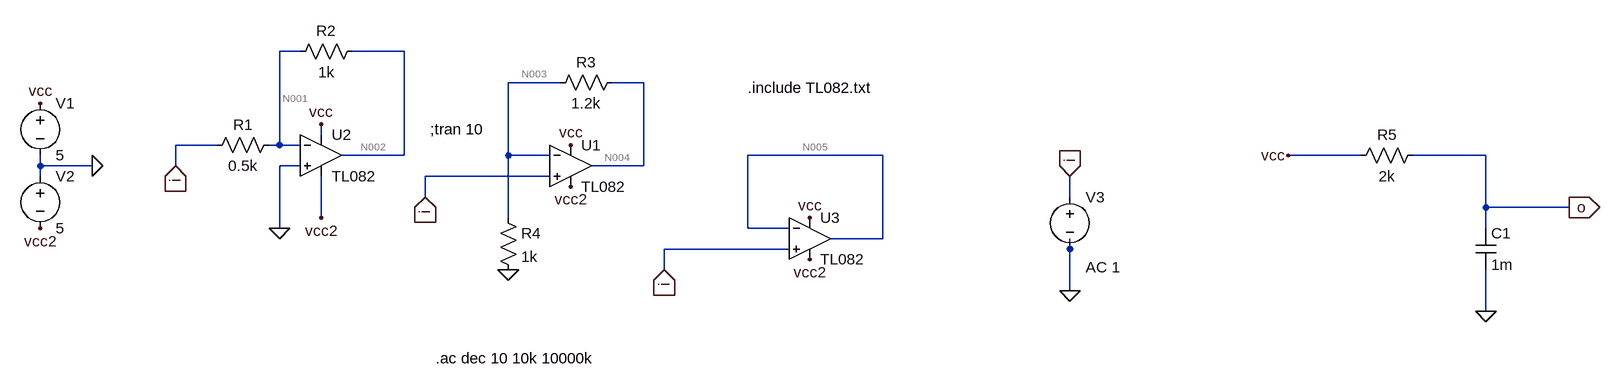
[diagram p0: schematic Wzmacniacze_lab1.asc]
Wzmacniacze_lab1.asc, the LTspice schematic file:
Version 4
SHEET 1 1200 680
WIRE -832 -48 -864 -48
WIRE -672 -48 -752 -48
WIRE -432 0 -512 0
WIRE -304 0 -352 0
WIRE -800 80 -800 64
WIRE -960 96 -1024 96
WIRE -864 96 -864 -48
WIRE -864 96 -880 96
WIRE -832 96 -864 96
WIRE -672 112 -672 -48
WIRE -672 112 -768 112
WIRE -512 112 -512 0
WIRE -448 112 -512 112
WIRE 64 112 -144 112
WIRE 800 112 688 112
WIRE 992 112 880 112
WIRE -1232 128 -1232 112
WIRE -1152 128 -1232 128
WIRE -1024 128 -1024 96
WIRE -832 128 -864 128
WIRE -304 128 -304 0
WIRE -304 128 -384 128
WIRE -1232 144 -1232 128
WIRE -448 144 -640 144
WIRE -640 176 -640 144
WIRE 352 176 352 144
WIRE 992 192 992 112
WIRE 1120 192 992 192
WIRE -800 208 -800 144
WIRE -512 208 -512 112
WIRE -864 224 -864 128
WIRE -144 224 -144 112
WIRE -80 224 -144 224
WIRE 992 224 992 192
WIRE 64 240 64 112
WIRE 64 240 -16 240
WIRE -80 256 -272 256
WIRE 352 256 352 240
WIRE -272 288 -272 256
WIRE 352 320 352 256
WIRE 992 352 992 288
FLAG -800 64 vcc
FLAG -1232 32 vcc
FLAG -1232 224 vcc2
FLAG -800 208 vcc2
FLAG -1152 128 0
FLAG -864 224 0
FLAG -416 160 vcc2
FLAG -416 96 vcc
FLAG -512 288 0
FLAG -48 272 vcc2
FLAG -48 208 vcc
FLAG 688 112 vcc
FLAG 992 352 0
FLAG 1120 192 o
IOPIN 1120 192 Out
FLAG -272 288 i
IOPIN -272 288 In
FLAG -640 176 i
IOPIN -640 176 In
FLAG -1024 128 i
IOPIN -1024 128 In
FLAG 352 144 i
IOPIN 352 144 In
FLAG 352 320 0
SYMBOL Opamps\\opamp2 -800 48 R0
SYMATTR InstName U2
SYMATTR Value TL082
SYMBOL voltage -1232 16 R0
WINDOW 123 0 0 Left 2
WINDOW 39 0 0 Left 2
SYMATTR InstName V1
SYMATTR Value 5
SYMBOL voltage -1232 128 R0
WINDOW 123 0 0 Left 2
WINDOW 39 0 0 Left 2
SYMATTR InstName V2
SYMATTR Value 5
SYMBOL res -848 -32 R270
WINDOW 0 32 56 VTop 2
WINDOW 3 0 56 VBottom 2
SYMATTR InstName R2
SYMATTR Value 1k
SYMBOL res -864 80 R90
WINDOW 0 0 56 VBottom 2
WINDOW 3 32 56 VTop 2
SYMATTR InstName R1
SYMATTR Value 0.5k
SYMBOL Opamps\\opamp2 -416 64 R0
SYMATTR InstName U1
SYMATTR Value TL082
SYMBOL res -448 16 R270
WINDOW 0 32 56 VTop 2
WINDOW 3 0 56 VBottom 2
SYMATTR InstName R3
SYMATTR Value 1.2k
SYMBOL res -528 192 R0
SYMATTR InstName R4
SYMATTR Value 1k
SYMBOL Opamps\\opamp2 -48 176 R0
SYMATTR InstName U3
SYMATTR Value TL082
SYMBOL cap 976 224 R0
SYMATTR InstName C1
SYMATTR Value 1m
SYMBOL res 896 96 R90
WINDOW 0 0 56 VBottom 2
WINDOW 3 32 56 VTop 2
SYMATTR InstName R5
SYMATTR Value 2k
SYMBOL voltage 352 160 R0
WINDOW 123 24 124 Left 2
WINDOW 39 0 0 Left 2
SYMATTR Value2 AC 1
SYMATTR InstName V3
SYMATTR Value ""
TEXT -144 8 Left 2 !.include TL082.txt
TEXT -624 424 Left 2 !.ac dec 10 10k 10000k
TEXT -632 72 Left 2 !;tran 10

The netlist it stands for:
* Wzmacniacze_lab1.asc
XU2 0 N001 vcc vcc2 N002 TL082  ; pins In+ In- V+ V- OUT
V1 vcc 0 5
V2 0 vcc2 5
R2 N001 N002 1k
R1 N001 i 0.5k
XU1 i N003 vcc vcc2 N004 TL082  ; pins In+ In- V+ V- OUT
R3 N003 N004 1.2k
R4 N003 0 1k
XU3 i N005 vcc vcc2 N005 TL082  ; pins In+ In- V+ V- OUT
C1 o 0 1m
R5 o vcc 2k
V3 i 0 AC 1
.include TL082.txt
.ac dec 10 10k 10000k
;tran 10
.backanno
.end

* Results of the author's LTspice run, read from the files saved beside the schematic
* Operating Point, zero values left out:
*   V(n002) = 32.95 µV
*   V(vcc2) = -5 V
*   V(vcc) = 5 V
*   V(n001) = 10.97 µV
*   V(n004) = 24.18 µV
*   V(n003) = 10.97 µV
*   V(n005) = 10.97 µV
*   V(o) = 5 V
*   I(R4) = 10.97 nA
*   I(R3) = -11.01 nA
*   I(R1) = 21.94 nA
*   I(R2) = -21.98 nA
*   I(V3) = 21.87 nA
*   I(V2) = -14.59 mA
*   I(V1) = -14.58 mA
*   Ix(u2:1) = 35.05 pA
*   Ix(u2:2) = 35.05 pA
*   Ix(u2:3) = 4.861 mA
*   Ix(u2:4) = -4.862 mA
*   Ix(u2:5) = -21.98 nA
*   Ix(u1:1) = 35.05 pA
*   Ix(u1:2) = 35.05 pA
*   Ix(u1:3) = 4.861 mA
*   Ix(u1:4) = -4.862 mA
*   Ix(u1:5) = -11.01 nA
*   Ix(u3:1) = 35.05 pA
*   Ix(u3:2) = 35.05 pA
*   Ix(u3:3) = 4.861 mA
*   Ix(u3:4) = -4.862 mA
*   Ix(u3:5) = -35.05 pA